# EAGLE design h_bridge_board (EAGLE 7.2.0)
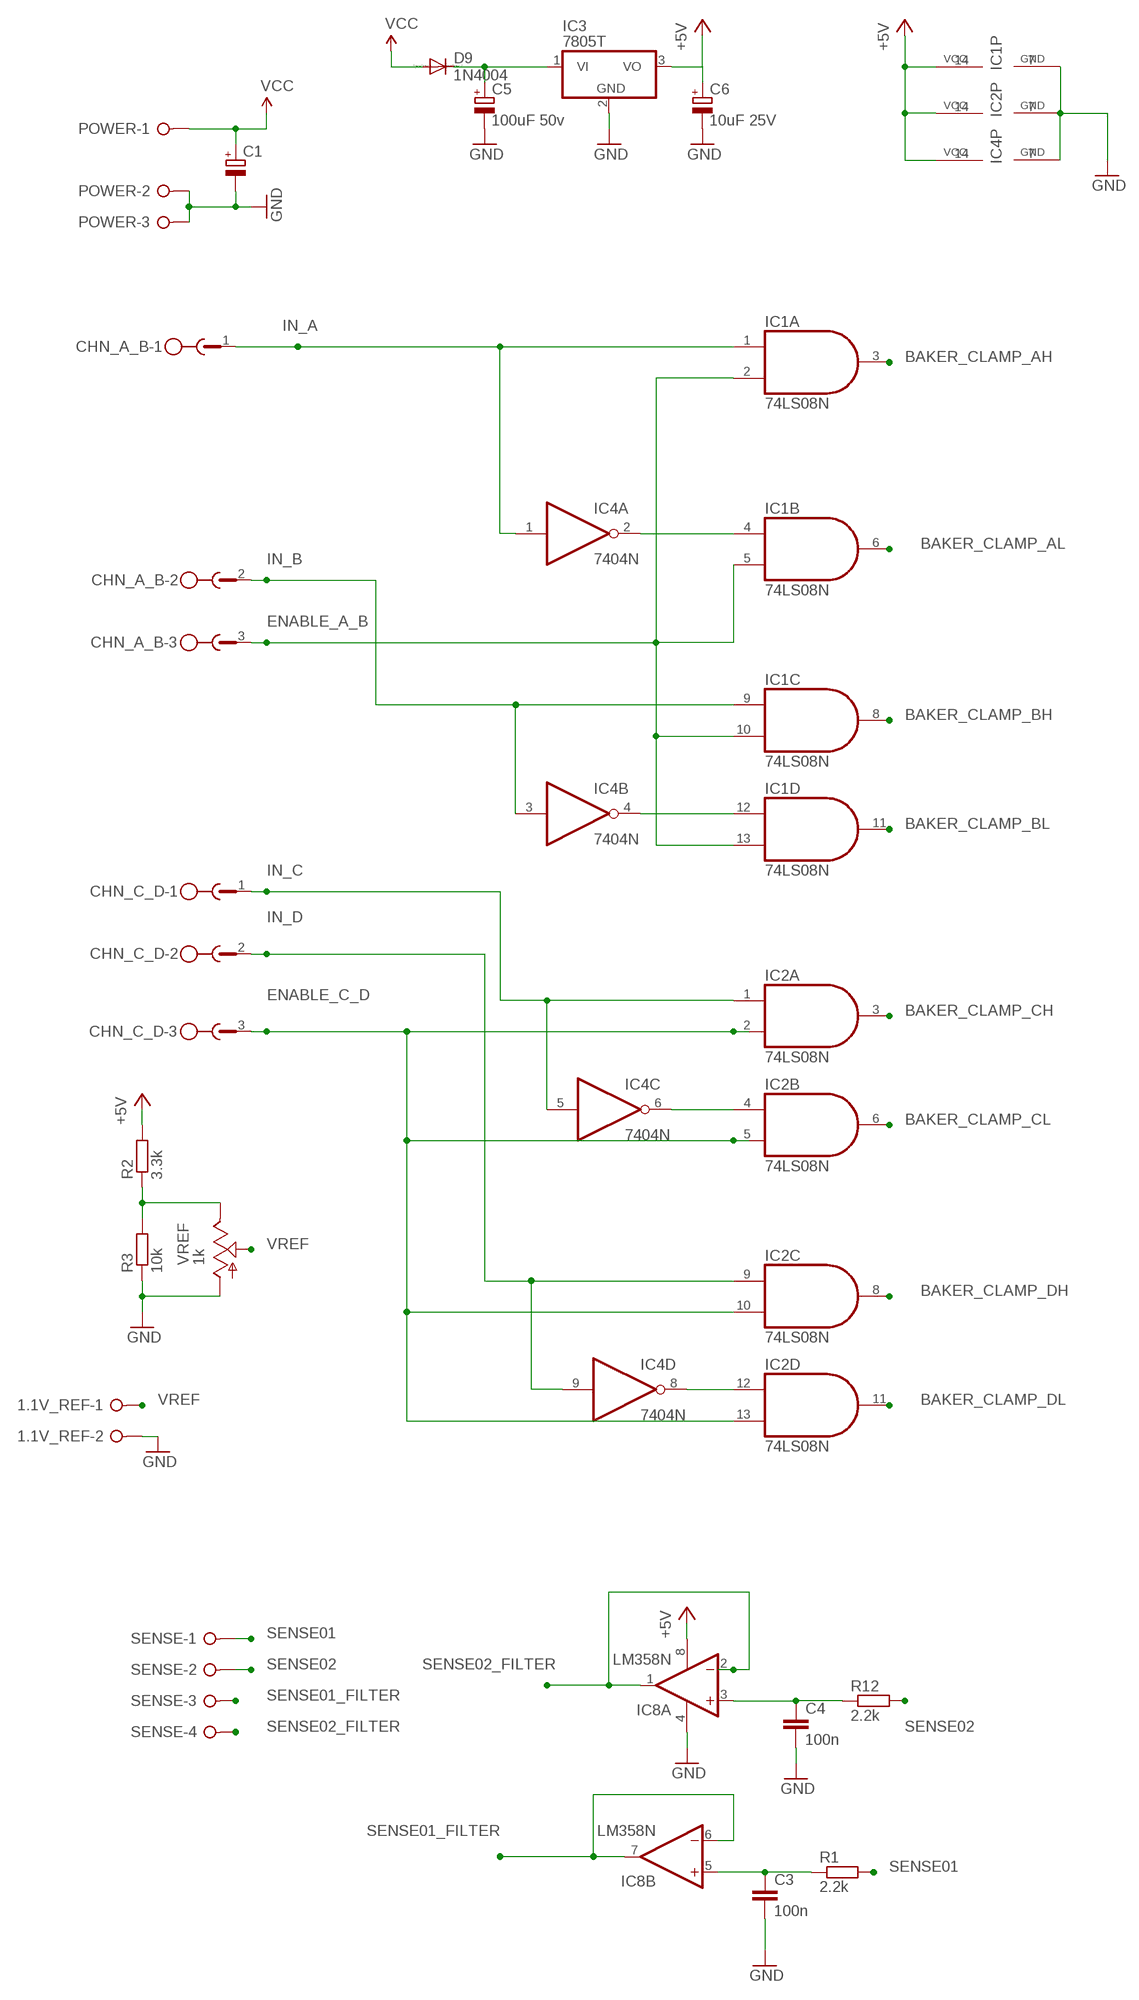
[diagram p0: schematic, sheet 1, part 1 of 2]
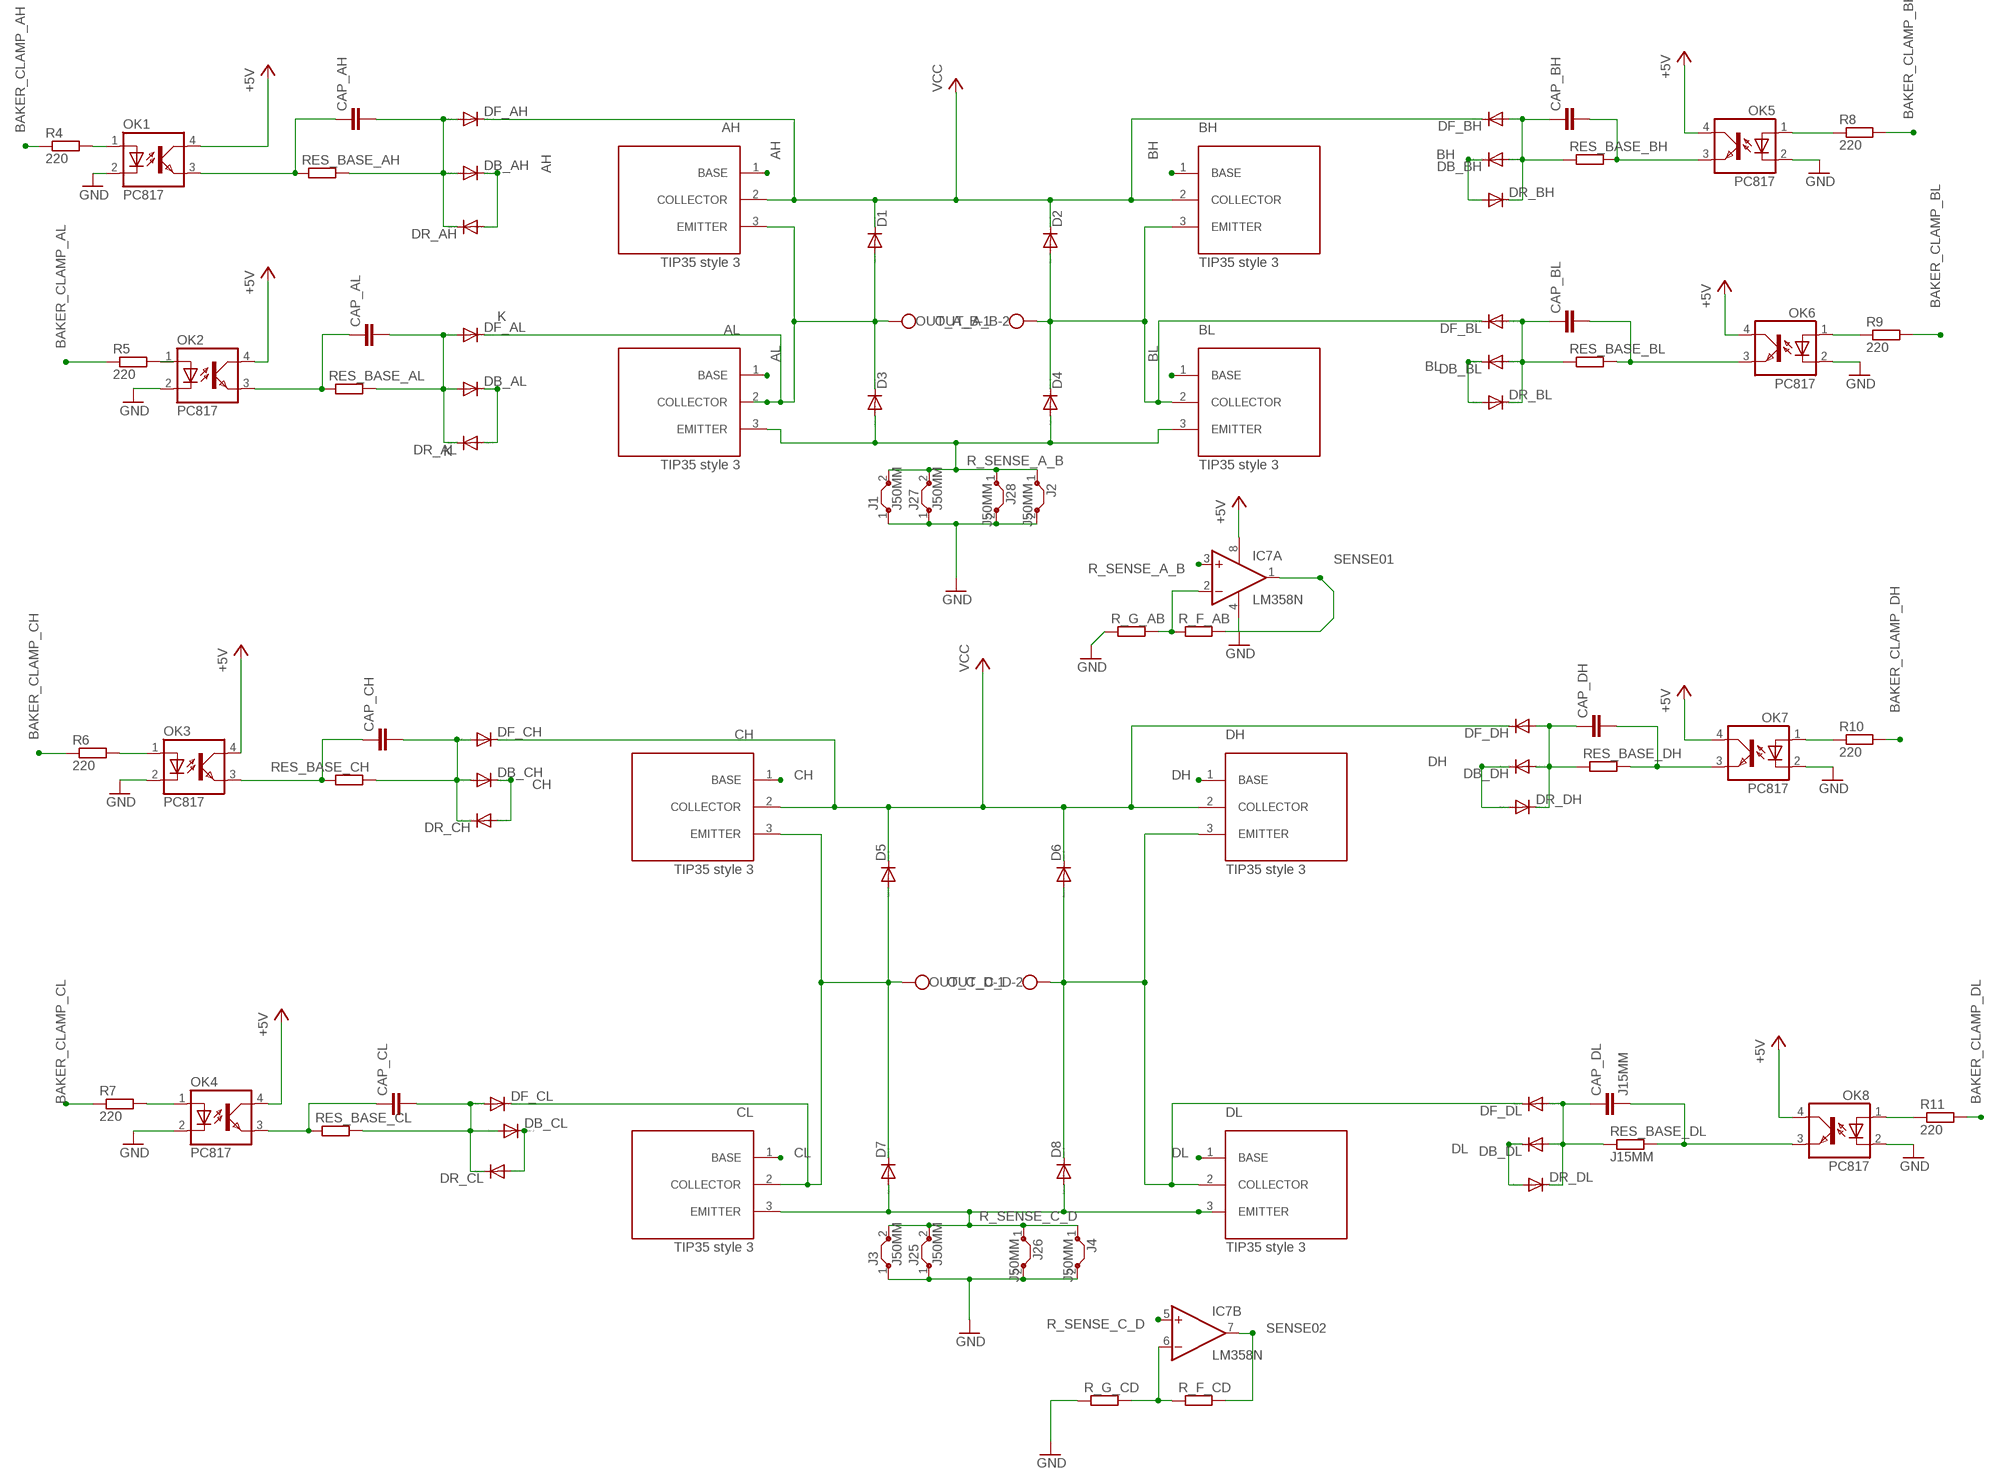
[diagram p1: schematic, sheet 1, part 2 of 2]

## Parts
1.1V_REF  W237-02P  [W237-132]
AH  TIP35_STYLE3  [P-TO247]
AL  TIP35_STYLE3  [P-TO247]
BH  TIP35_STYLE3  [P-TO247]
BL  TIP35_STYLE3  [P-TO247]
C1  CPOL-EUE5-10.5  [E5-10,5]
C3  100n  C-EU050-030X075  [C050-030X075]
C4  100n  C-EU050-030X075  [C050-030X075]
C5  100uF 50v  CPOL-EUE5-10.5  [E5-10,5]
C6  10uF 25V  CPOL-EUE2.5-6  [E2,5-6]
CAP_AH  C-EU050-030X075  [C050-030X075]
CAP_AL  C-EU050-030X075  [C050-030X075]
CAP_BH  C-EU050-030X075  [C050-030X075]
CAP_BL  C-EU050-030X075  [C050-030X075]
CAP_CH  C-EU050-030X075  [C050-030X075]
CAP_CL  C-EU050-030X075  [C050-030X075]
CAP_DH  C-EU050-030X075  [C050-030X075]
CAP_DL  J15MM  C-EU050-030X075  [C050-030X075]
CH  TIP35_STYLE3  [P-TO247]
CHN_A_B  W232-3  [W232-3]
CHN_C_D  W232-3  [W232-3]
CL  TIP35_STYLE3  [P-TO247]
D1  DIODE-DO27-15  [DO27-15]
D2  DIODE-DO27-15  [DO27-15]
D3  DIODE-DO27-15  [DO27-15]
D4  DIODE-DO27-15  [DO27-15]
D5  DIODE-DO27-15  [DO27-15]
D6  DIODE-DO27-15  [DO27-15]
D7  DIODE-DO27-15  [DO27-15]
D8  DIODE-DO27-15  [DO27-15]
D9  1N4004  [DO41-10]
DB_AH  DIODE-DO27-15  [DO27-15]
DB_AL  DIODE-DO27-15  [DO27-15]
DB_BH  DIODE-DO27-15  [DO27-15]
DB_BL  DIODE-DO27-15  [DO27-15]
DB_CH  DIODE-DO27-15  [DO27-15]
DB_CL  DIODE-DO27-15  [DO27-15]
DB_DH  DIODE-DO27-15  [DO27-15]
DB_DL  DIODE-DO27-15  [DO27-15]
DF_AH  DIODE-DO27-15  [DO27-15]
DF_AL  DIODE-DO27-15  [DO27-15]
DF_BH  DIODE-DO27-15  [DO27-15]
DF_BL  DIODE-DO27-15  [DO27-15]
DF_CH  DIODE-DO27-15  [DO27-15]
DF_CL  DIODE-DO27-15  [DO27-15]
DF_DH  DIODE-DO27-15  [DO27-15]
DF_DL  DIODE-DO27-15  [DO27-15]
DH  TIP35_STYLE3  [P-TO247]
DL  TIP35_STYLE3  [P-TO247]
DR_AH  DIODE-DO27-15  [DO27-15]
DR_AL  DIODE-DO27-15  [DO27-15]
DR_BH  DIODE-DO27-15  [DO27-15]
DR_BL  DIODE-DO27-15  [DO27-15]
DR_CH  DIODE-DO27-15  [DO27-15]
DR_CL  DIODE-DO27-15  [DO27-15]
DR_DH  DIODE-DO27-15  [DO27-15]
DR_DL  DIODE-DO27-15  [DO27-15]
IC1  74LS08N  [DIL14]
IC2  74LS08N  [DIL14]
IC3  7805T  [TO220H]
IC4  7404N  [DIL14]
IC7  LM358N  [DIL08]
IC8  LM358N  [DIL08]
J1  J50MM  [50]
J2  J50MM  [50]
J3  J50MM  [50]
J4  J50MM  [50]
J25  J50MM  [50]
J26  J50MM  [50]
J27  J50MM  [50]
J28  J50MM  [50]
OK1  PC817  [DIL04]
OK2  PC817  [DIL04]
OK3  PC817  [DIL04]
OK4  PC817  [DIL04]
OK5  PC817  [DIL04]
OK6  PC817  [DIL04]
OK7  PC817  [DIL04]
OK8  PC817  [DIL04]
OUT_A_B  W237-102  [W237-102]
OUT_C_D  W237-102  [W237-102]
POWER  W237-3E  [W237-3E]
R1  2.2k  R-EU_0207/10  [0207/10]
R2  3.3k  R-EU_0207/10  [0207/10]
R3  10k  R-EU_0207/10  [0207/10]
R4  220  R-EU_0207/10  [0207/10]
R5  220  R-EU_0207/10  [0207/10]
R6  220  R-EU_0207/10  [0207/10]
R7  220  R-EU_0207/10  [0207/10]
R8  220  R-EU_0207/10  [0207/10]
R9  220  R-EU_0207/10  [0207/10]
R10  220  R-EU_0207/10  [0207/10]
R11  220  R-EU_0207/10  [0207/10]
R12  2.2k  R-EU_0207/10  [0207/10]
R_F_AB  R-EU_0207/10  [0207/10]
R_F_CD  R-EU_0207/10  [0207/10]
R_G_AB  R-EU_0207/10  [0207/10]
R_G_CD  R-EU_0207/10  [0207/10]
RES_BASE_AH  R-EU_0207/10  [0207/10]
RES_BASE_AL  R-EU_0207/10  [0207/10]
RES_BASE_BH  R-EU_0207/10  [0207/10]
RES_BASE_BL  R-EU_0207/10  [0207/10]
RES_BASE_CH  R-EU_0207/10  [0207/10]
RES_BASE_CL  R-EU_0207/10  [0207/10]
RES_BASE_DH  R-EU_0207/10  [0207/10]
RES_BASE_DL  J15MM  R-EU_0207/10  [0207/10]
SENSE  W237-04P  [W237-4P]
VREF  1k  TRIM_US-B25U  [B25U]

## Nets
+5V: C6.+ IC1.14(P:VCC) IC2.14(P:VCC) IC3.3(VO) IC4.14(P:VCC) IC7.8(P:V+) IC8.8(P:V+) OK1.4(COL) OK2.4(COL) OK3.4(COL) OK4.4(COL) OK5.4(COL) OK6.4(COL) OK7.4(COL) OK8.4(COL) R2.2
AH: AH.1(BASE) DB_AH.C DR_AH.A
AL: AL.1(BASE) DB_AL.C DR_AL.A
BAKER_CLAMP_AH: IC1.3(A:O) R4.1
BAKER_CLAMP_AL: IC1.6(B:O) R5.1
BAKER_CLAMP_BH: IC1.8(C:O) R8.2
BAKER_CLAMP_BL: IC1.11(D:O) R9.2
BAKER_CLAMP_CH: IC2.3(A:O) R6.1
BAKER_CLAMP_CL: IC2.6(B:O) R7.1
BAKER_CLAMP_DH: IC2.8(C:O) R10.2
BAKER_CLAMP_DL: IC2.11(D:O) R11.2
BH: BH.1(BASE) DB_BH.C DR_BH.A
BL: BL.1(BASE) DB_BL.C DR_BL.A
CH: CH.1(BASE) DB_CH.C DR_CH.A
CL: CL.1(BASE) DB_CL.C DR_CL.A
DH: DB_DH.C DH.1(BASE) DR_DH.A
DL: DB_DL.C DL.1(BASE) DR_DL.A
ENABLE_A_B: CHN_A_B.3 IC1.2(A:I1) IC1.5(B:I1) IC1.10(C:I1) IC1.13(D:I1)
ENABLE_C_D: CHN_C_D.3 IC2.2(A:I1) IC2.5(B:I1) IC2.10(C:I1) IC2.13(D:I1)
GND: 1.1V_REF.2 C1.- C3.2 C4.2 C5.- C6.- IC1.7(P:GND) IC2.7(P:GND) IC3.2(GND) IC4.7(P:GND) IC7.4(P:V-) IC8.4(P:V-) J1.1 J2.2 J3.1 J4.2 J25.1 J26.2 J27.1 J28.2 OK1.2(C) OK2.2(C) OK3.2(C) OK4.2(C) OK5.2(C) OK6.2(C) OK7.2(C) OK8.2(C) POWER.2 POWER.3 R3.1 R_G_AB.1 R_G_CD.1 VREF.A
IN_A: CHN_A_B.1 IC1.1(A:I0) IC4.1(A:I)
IN_B: CHN_A_B.2 IC1.9(C:I0) IC4.3(B:I)
IN_C: CHN_C_D.1 IC2.1(A:I0) IC4.5(C:I)
IN_D: CHN_C_D.2 IC2.9(C:I0) IC4.9(D:I)
N$1: IC1.12(D:I0) IC4.4(B:O)
N$2: R2.1 R3.2 VREF.E
N$3: C5.+ D9.C IC3.1(VI)
N$4: CAP_AL.2 DB_AL.A DF_AL.A DR_AL.C RES_BASE_AL.2
N$5: CAP_CH.2 DB_CH.A DF_CH.A DR_CH.C RES_BASE_CH.1
N$6: CAP_BL.1 DB_BL.A DF_BL.A DR_BL.C RES_BASE_BL.1
N$8: CAP_DH.1 DB_DH.A DF_DH.A DR_DH.C RES_BASE_DH.1
N$11: IC2.4(B:I0) IC4.6(C:O)
N$12: OK1.1(A) R4.2
N$13: IC2.12(D:I0) IC4.8(D:O)
N$14: OK2.1(A) R5.2
N$15: OK3.1(A) R6.2
N$16: IC7.6(B:-IN) R_F_CD.1 R_G_CD.2
N$17: OK4.1(A) R7.2
N$18: IC7.2(A:-IN) R_F_AB.1 R_G_AB.2
N$19: CAP_CL.2 DB_CL.A DF_CL.A DR_CL.C RES_BASE_CL.2
N$20: CAP_AH.2 DB_AH.A DF_AH.A DR_AH.C RES_BASE_AH.2
N$21: CAP_BH.1 DB_BH.A DF_BH.A DR_BH.C RES_BASE_BH.1
N$25: IC1.4(B:I0) IC4.2(A:O)
N$27: OK8.1(A) R11.1
N$29: CAP_DL.1 DB_DL.A DF_DL.A DR_DL.C RES_BASE_DL.1
N$30: OK7.1(A) R10.1
N$32: OK6.1(A) R9.1
N$33: OK5.1(A) R8.1
N$34: CAP_DL.2 OK8.3(EMIT) RES_BASE_DL.2
N$35: CAP_BH.2 OK5.3(EMIT) RES_BASE_BH.2
N$36: CAP_BL.2 OK6.3(EMIT) RES_BASE_BL.2
N$37: CAP_DH.2 OK7.3(EMIT) RES_BASE_DH.2
N$38: CAP_CL.1 OK4.3(EMIT) RES_BASE_CL.1
N$39: CAP_CH.1 OK3.3(EMIT) RES_BASE_CH.2
N$42: CAP_AL.1 OK2.3(EMIT) RES_BASE_AL.1
N$43: CAP_AH.1 OK1.3(EMIT) RES_BASE_AH.1
N$46: C3.1 IC8.5(B:+IN) R1.1
N$47: C4.1 IC8.3(A:+IN) R12.1
OUT_A: AH.3(EMITTER) AL.2(COLLECTOR) D1.A D3.C DF_AL.C OUT_A_B.1
OUT_B: BH.3(EMITTER) BL.2(COLLECTOR) D2.A D4.C DF_BL.C OUT_A_B.2
OUT_C: CH.3(EMITTER) CL.2(COLLECTOR) D5.A D7.C DF_CL.C OUT_C_D.1
OUT_D: D6.A D8.C DF_DL.C DH.3(EMITTER) DL.2(COLLECTOR) OUT_C_D.2
R_SENSE_A_B: AL.3(EMITTER) BL.3(EMITTER) D3.A D4.A IC7.3(A:+IN) J1.2 J2.1 J27.2 J28.1
R_SENSE_C_D: CL.3(EMITTER) D7.A D8.A DL.3(EMITTER) IC7.5(B:+IN) J3.2 J4.1 J25.2 J26.1
SENSE01: IC7.1(A:OUT) R1.2 R_F_AB.2 SENSE.1
SENSE01_FILTER: IC8.6(B:-IN) IC8.7(B:OUT) SENSE.3
SENSE02: IC7.7(B:OUT) R12.2 R_F_CD.2 SENSE.2
SENSE02_FILTER: IC8.1(A:OUT) IC8.2(A:-IN) SENSE.4
VCC: AH.2(COLLECTOR) BH.2(COLLECTOR) C1.+ CH.2(COLLECTOR) D1.C D2.C D5.C D6.C D9.A DF_AH.C DF_BH.C DF_CH.C DF_DH.C DH.2(COLLECTOR) POWER.1
VREF: 1.1V_REF.1 VREF.S
Unconnected: IC4.10(E:O) IC4.11(E:I) IC4.12(F:O) IC4.13(F:I)

## Notes on the sheet
- K
- K

## Library data of the parts
1.1V_REF = con-wago-508:W237-02P: WAGO SREW CLAMP; OC_FARNELL: unknown; OC_NEWARK: unknown
AH AL BH BL CH CL DH DL = tip35_style3:TIP35_STYLE3
C1 C5 C6 = rcl:CPOL-EU: POLARIZED CAPACITOR, European symbol
C3 C4 CAP_AH CAP_AL CAP_BH CAP_BL CAP_CH CAP_CL CAP_DH CAP_DL = rcl:C-EU: CAPACITOR, European symbol
CHN_A_B CHN_C_D = con-wago-508:W232-3: WAGO SREW CLAMP; OC_FARNELL: unknown; OC_NEWARK: unknown
D1-D8 DB_AH DB_AL DB_BH DB_BL DB_CH DB_CL DB_DH DB_DL DF_AH DF_AL DF_BH DF_BL DF_CH DF_CL DF_DH DF_DL DR_AH DR_AL DR_BH DR_BL DR_CH DR_CL DR_DH DR_DL = diode:DIODE-: DIODE
D9 = diode:1N4004: DIODE general purpose rectifier, 1 A
IC1 IC2 = 74xx-us:74*08: Quad 2-input AND gate
IC3 = linear:78*: Positive VOLTAGE REGULATOR Source: http://cache.national.com/ds/LM/LM78L05.pdf http://www.fairchildsemi.com/ds/LM/LM7805.pdf
IC4 = 74xx-us:74*04: Hex INVERTER
IC7 IC8 = linear:LM358: OP AMP also LM158; LM258; LM2904 Source: http://cache.national.com/ds/LM/LM158.pdf
J1-J4 J25-J28 = jumper:J: Bridge
OK1-OK8 = optocoupler:PC817: SHARP OPTO COUPLER; MPN: PC817X4J000F; OC_FARNELL: 9707727; OC_NEWARK: 97K7059
OUT_A_B OUT_C_D = con-wago-500:W237-102: WAGO SCREW CLAMP; MPN: 237-102; OC_FARNELL: unknown; OC_NEWARK: 70K9898
POWER = con-wago-508:W237-3E: WAGO SREW CLAMP; OC_FARNELL: unknown; OC_NEWARK: unknown
R1-R12 R_F_AB R_F_CD R_G_AB R_G_CD RES_BASE_AH RES_BASE_AL RES_BASE_BH RES_BASE_BL RES_BASE_CH RES_BASE_CL RES_BASE_DH RES_BASE_DL = rcl:R-EU_: RESISTOR, European symbol
SENSE = con-wago-508:W237-04P: WAGO SREW CLAMP; OC_FARNELL: unknown; OC_NEWARK: unknown
VREF = pot:TRIM_US-: POTENTIOMETER

## Board
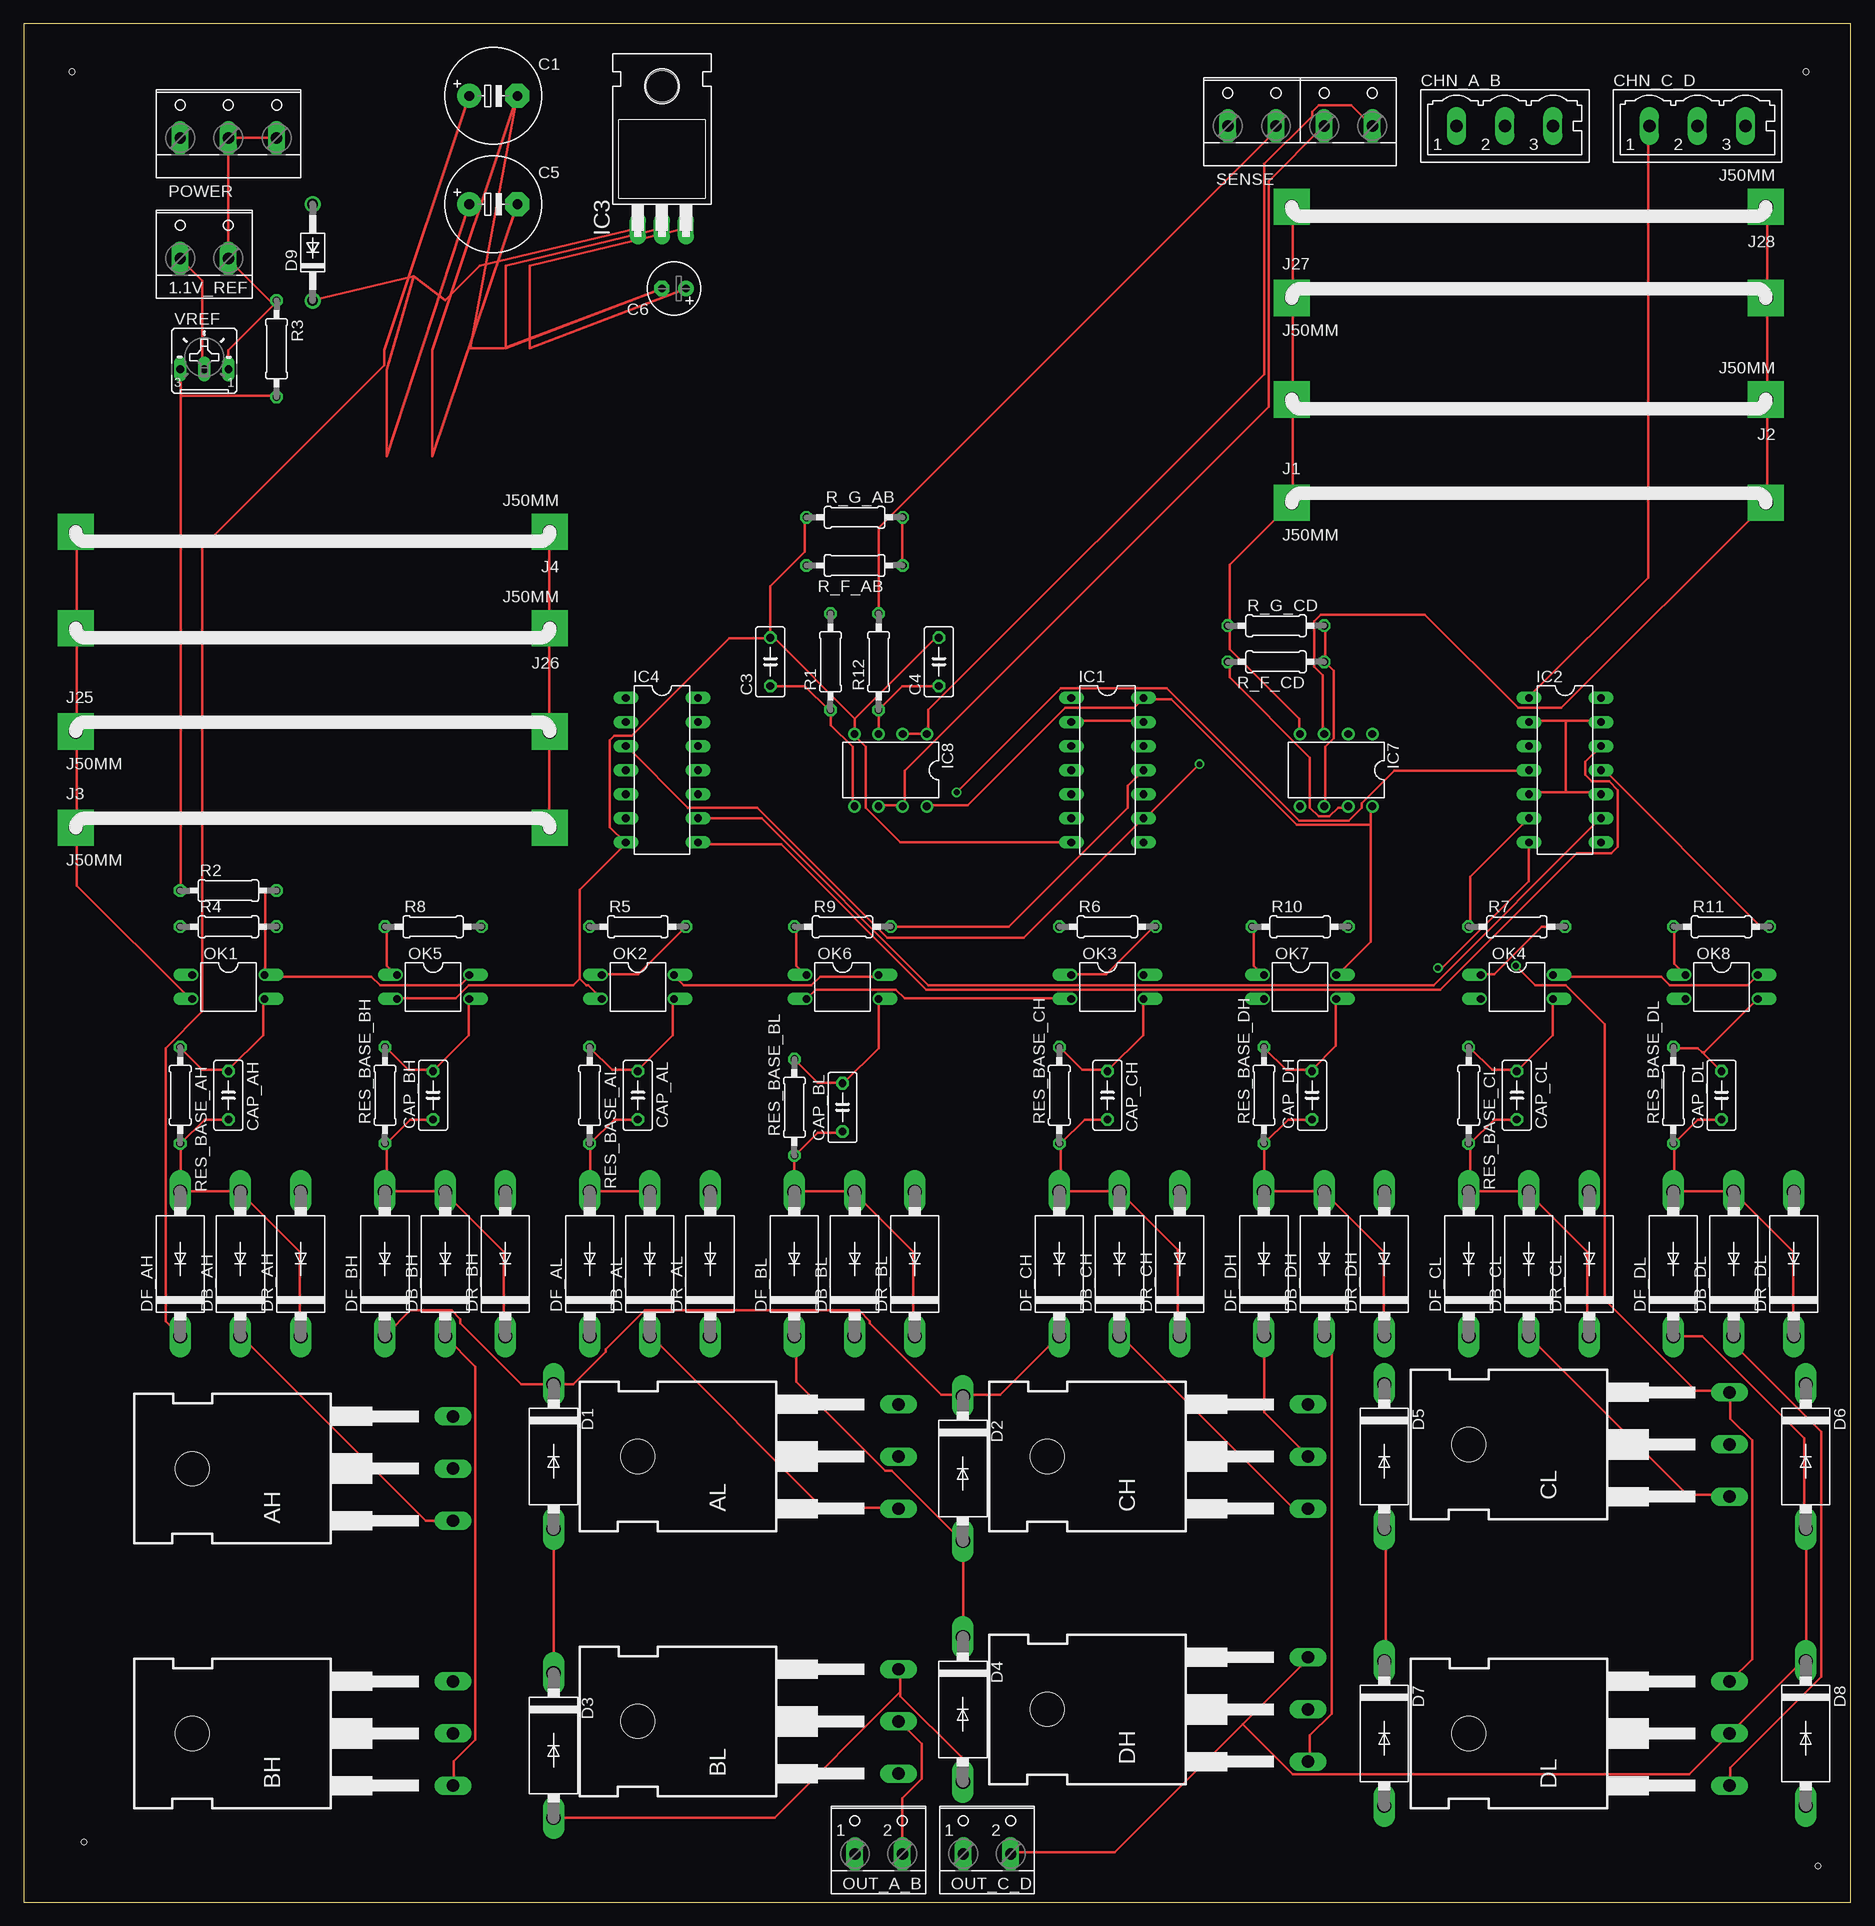
[diagram p2: board, top side]
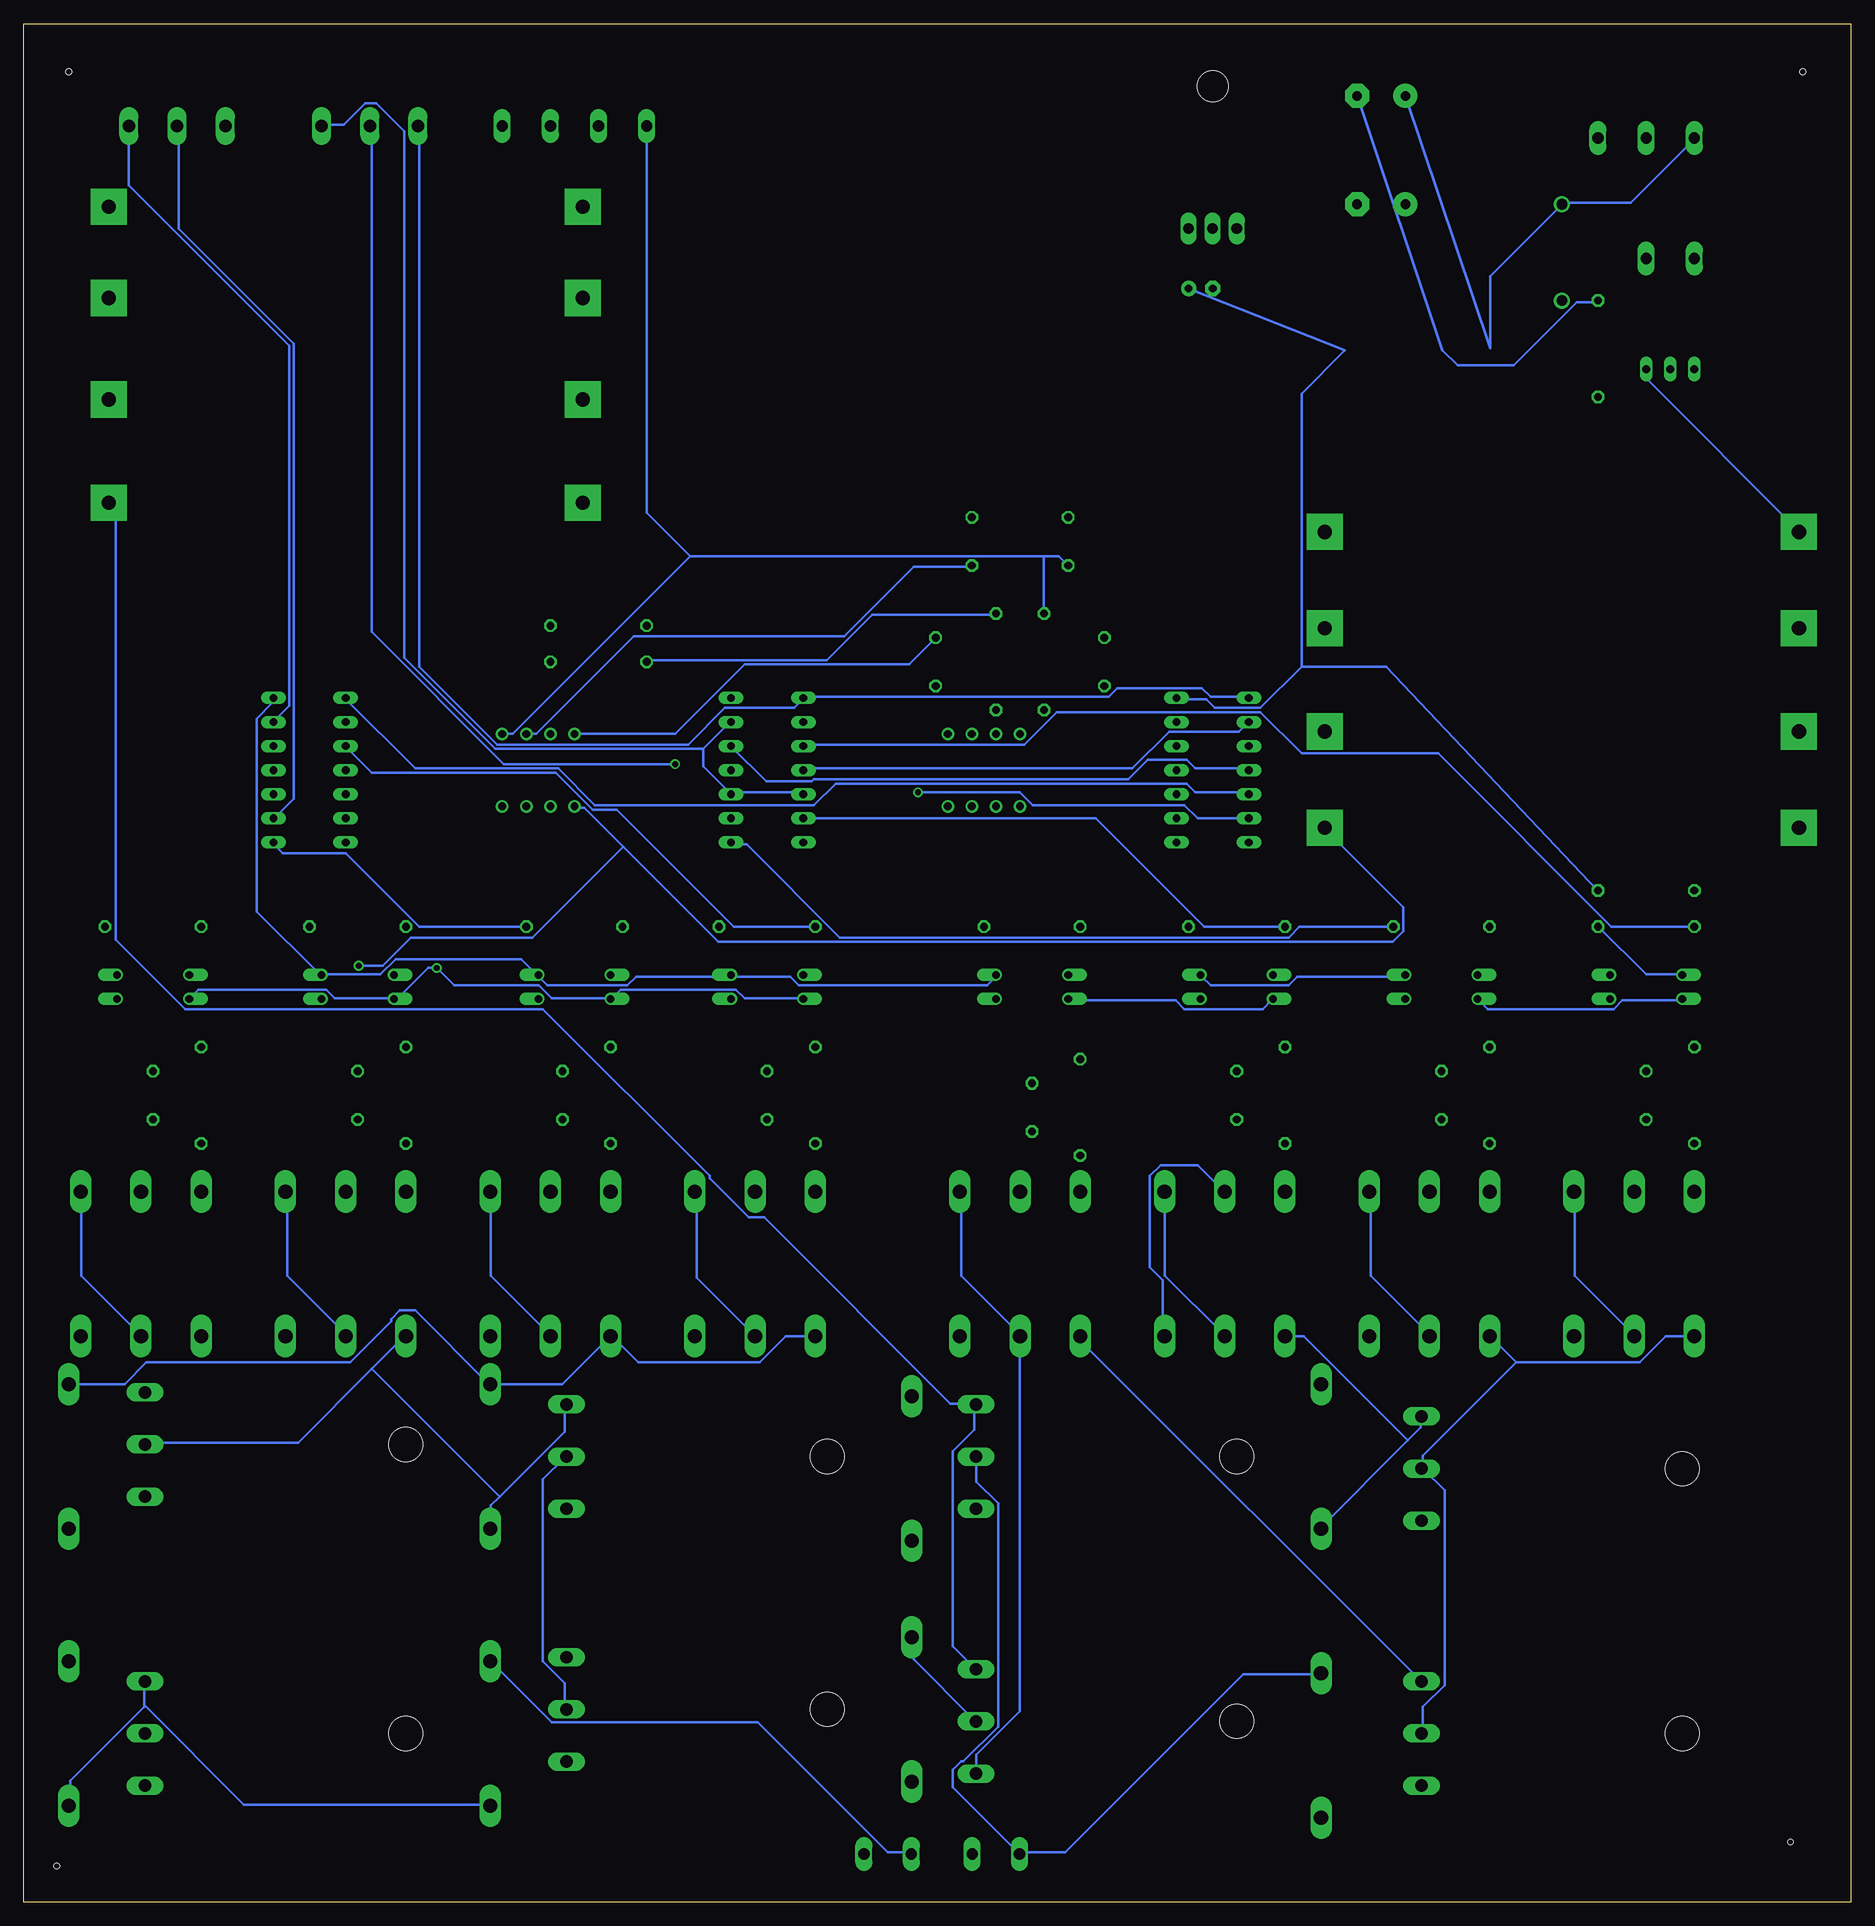
[diagram p3: board, bottom side, seen from below]

Size 192.71 x 198.11 mm. Coordinates in mm from the lower left corner, seen from the top.
Outline: 0,0 192.71,0 192.71,198.11 0,198.11 0,0
Copper layers (1*16): Top 0.035mm / dielectric 1.5mm / Bottom 0.035mm
Design rules "default *": minimum track width 10mil, minimum drill 24mil, track to track 8mil, track to pad 8mil, pad to pad 8mil, via to via 8mil, smd to smd 8mil, copper to edge 100mil, drill to drill 8mil, minimum pad ring 10mil, minimum via ring 8mil, stop-mask expansion 4mil, vias tented up to drill 0mil, thermal gap 10mil
Holes 0.6 mm at 5.08,193.04 187.96,193.04 6.35,6.35 189.23,3.81

### Footprints (pad centres in the part's own frame; a part is rotated, then mirrored left to right if it is on the bottom)
W237-132 = drill 1.194 long: 1 -2.54,-0.635; 2 2.54,-0.635
P-TO247 = drill 1.3 long: 1 -5.5,-27.5; 2 0,-27.5; 3 5.5,-27.5 | hole 3.6: 0,0
E5-10,5 = drill 1.016 pad 2.54: + -2.54,0 | drill 1.016 pad 2.54 octagon: - 2.54,0
C050-030X075 = drill 0.813 octagon: 1 -2.54,0; 2 2.54,0
E2,5-6 = drill 0.813 pad 1.6: + -1.27,0 | drill 0.813 pad 1.6 octagon: - 1.27,0
W232-3 = drill 1.321 long: 1 -5.08,-0.635; 2 0,-0.635; 3 5.08,-0.635
DO27-15 = drill 1.499 long: A 7.62,0; C -7.62,0
DO41-10 = drill 1.118: A 5.08,0; C -5.08,0
DIL14 = drill 0.813 long: 1 -7.62,-3.81; 2 -5.08,-3.81; 3 -2.54,-3.81; 4 0,-3.81; 5 2.54,-3.81; 6 5.08,-3.81; 7 7.62,-3.81; 8 7.62,3.81; 9 5.08,3.81; 10 2.54,3.81; 11 0,3.81; 12 -2.54,3.81; 13 -5.08,3.81; 14 -7.62,3.81
TO220H = drill 1.118 long: 1 -2.54,-10.16; 2 0,-10.16; 3 2.54,-10.16 | hole 3.302: 0,4.826
DIL08 = drill 0.813 pad 1.27: 1 -3.81,-3.81; 2 -1.27,-3.81; 3 1.27,-3.81; 4 3.81,-3.81; 5 3.81,3.81; 6 1.27,3.81; 7 -1.27,3.81; 8 -3.81,3.81
50 = drill 1.5 pad 3.81 square: 1 -25,-1; 2 25,-1
DIL04 = drill 0.813 offset: 1 -1.27,-3.81; 2 1.27,-3.81; 3 1.27,3.81; 4 -1.27,3.81
W237-102 = drill 1.194 long: 1 -2.5,-1.27; 2 2.5,-1.27
W237-3E = drill 1.194 long: 1 -5.08,-0.635; 2 0,-0.635; 3 5.08,-0.635
0207/10 = drill 0.813 octagon: 1 -5.08,0; 2 5.08,0
W237-4P = drill 1.194 long: 1 -7.62,-0.635; 2 -2.54,-0.635; 3 2.54,-0.635; 4 7.62,-0.635
B25U = drill 0.813 long: A 2.54,-0.889; E -2.54,-0.889; S 0,-0.889

### Placement (x,y rotation side)
1.1V_REF  19.05,173.99 0 top
AH  17.78,45.72 90 top
AL  64.77,46.99 90 top
BH  17.78,17.78 90 top
BL  64.77,19.05 90 top
C1  49.53,190.5 0 top
C3  78.74,130.81 90 top
C4  96.52,130.81 90 top
C5  49.53,179.07 0 top
C6  68.58,170.18 180 top
CAP_AH  21.59,85.09 270 top
CAP_AL  64.77,85.09 270 top
CAP_BH  43.18,85.09 90 top
CAP_BL  86.36,83.82 90 top
CAP_CH  114.3,85.09 270 top
CAP_CL  157.48,85.09 270 top
CAP_DH  135.89,85.09 90 top
CAP_DL  179.07,85.09 90 top
CH  107.95,46.99 90 top
CHN_A_B  156.21,187.96 0 top
CHN_C_D  176.53,187.96 0 top
CL  152.4,48.26 90 top
D1  55.88,46.99 270 top
D2  99.06,45.72 270 top
D3  55.88,16.51 270 top
D4  99.06,20.32 270 top
D5  143.51,46.99 270 top
D6  187.96,46.99 270 top
D7  143.51,17.78 270 top
D8  187.96,17.78 270 top
D9  30.48,173.99 90 top
DB_AH  22.86,67.31 90 top
DB_AL  66.04,67.31 90 top
DB_BH  44.45,67.31 90 top
DB_BL  87.63,67.31 90 top
DB_CH  115.57,67.31 90 top
DB_CL  158.75,67.31 90 top
DB_DH  137.16,67.31 90 top
DB_DL  180.34,67.31 90 top
DF_AH  16.51,67.31 90 top
DF_AL  59.69,67.31 90 top
DF_BH  38.1,67.31 90 top
DF_BL  81.28,67.31 90 top
DF_CH  109.22,67.31 90 top
DF_CL  152.4,67.31 90 top
DF_DH  130.81,67.31 90 top
DF_DL  173.99,67.31 90 top
DH  107.95,20.32 90 top
DL  152.4,17.78 90 top
DR_AH  29.21,67.31 90 top
DR_AL  72.39,67.31 90 top
DR_BH  50.8,67.31 90 top
DR_BL  93.98,67.31 90 top
DR_CH  121.92,67.31 90 top
DR_CL  165.1,67.31 90 top
DR_DH  143.51,67.31 90 top
DR_DL  186.69,67.31 90 top
IC1  114.3,119.38 270 top
IC2  162.56,119.38 270 top
IC3  67.31,186.69 0 top
IC4  67.31,119.38 270 top
IC7  138.43,119.38 180 top
IC8  91.44,119.38 180 top
J1  158.75,148.59 0 top
J2  158.75,157.48 180 top
J3  30.48,114.3 0 top
J4  30.48,143.51 180 top
J25  30.48,124.46 0 top
J26  30.48,133.35 180 top
J27  158.75,170.18 0 top
J28  158.75,177.8 180 top
OK1  21.59,96.52 270 top
OK2  64.77,96.52 270 top
OK3  114.3,96.52 270 top
OK4  157.48,96.52 270 top
OK5  43.18,96.52 270 top
OK6  86.36,96.52 270 top
OK7  134.62,96.52 270 top
OK8  179.07,96.52 270 top
OUT_A_B  90.17,6.35 0 top
OUT_C_D  101.6,6.35 0 top
POWER  21.59,186.69 0 top
R1  85.09,130.81 90 top
R2  21.59,106.68 0 top
R3  26.67,163.83 270 top
R4  21.59,102.87 0 top
R5  64.77,102.87 0 top
R6  114.3,102.87 0 top
R7  157.48,102.87 0 top
R8  43.18,102.87 0 top
R9  86.36,102.87 0 top
R10  134.62,102.87 0 top
R11  179.07,102.87 0 top
R12  90.17,130.81 90 top
R_F_AB  87.63,140.97 180 top
R_F_CD  132.08,130.81 180 top
R_G_AB  87.63,146.05 0 top
R_G_CD  132.08,134.62 0 top
RES_BASE_AH  16.51,85.09 270 top
RES_BASE_AL  59.69,85.09 270 top
RES_BASE_BH  38.1,85.09 90 top
RES_BASE_BL  81.28,83.82 90 top
RES_BASE_CH  109.22,85.09 90 top
RES_BASE_CL  152.4,85.09 270 top
RES_BASE_DH  130.81,85.09 90 top
RES_BASE_DL  173.99,85.09 90 top
SENSE  134.62,187.96 0 top
VREF  19.05,162.56 0 top

### Tracks (layer width: path | path; a pad name or v marks a point on that pad's centre or on a via)
+5V
  Top 0.254: OK4.4 161.49,97.61 172.69,97.61 173.61,96.7 181.84,96.7 182.75,97.61 OK8.4 | IC8.8 95.43,115.67 99.54,115.67 109.83,125.96 117.14,125.96 118.06,126.87 IC1.14 118.29,126.87 121.03,126.87 134.29,113.61 142.06,113.61 | 142.06,113.61 142.06,101.27 138.63,97.84 OK7.4 | 142.06,113.61 142.06,115.44 IC7.8 | IC3.3 53.36,172.59 53.36,163.91 C6.+ | R2.2 25.48,106.76 25.48,97.84 OK1.4 25.48,97.61 36.68,97.61 37.59,96.7 46.05,96.7 46.97,97.61 OK5.4 | OK6.4 90.17,97.61 84,97.61 83.08,96.7 69.6,96.7 68.68,97.61 OK2.4
  Bottom 0.254: IC2.14 166.52,126.87 166.52,126.42 168.12,124.82 168.12,104.47 161.49,97.84 OK4.4 161.26,97.84 155.09,97.84 153.49,99.44 140.23,99.44 138.63,97.84 OK7.4 138.41,97.61 137.49,96.7 129.03,96.7 128.12,97.61 118.29,97.61 OK3.4 118.06,97.61 111.89,97.61 110.97,96.7 91.08,96.7 90.17,97.61 OK6.4 | 57.94,130.3 62.28,125.96 67.08,125.96 68,126.87 70.97,126.87 IC4.14 | 57.94,130.3 57.94,159.11 53.36,163.68 C6.+ | OK5.4 47.19,97.61 58.39,97.61 59.31,96.7 67.54,96.7 68.45,97.61 OK2.4 | 57.94,130.3 49.02,130.3 R2.2
AH
  Top 0.254: AH.1 45.14,40.23 42.39,40.23 22.96,59.66 DB_AH.C
  Bottom 0.254: DR_AH.A 29.13,74.75 29.13,66.06 22.96,59.89 DB_AH.C
AL
  Top 0.254: AL.1 92.23,41.6 84.23,41.6 66.17,59.66 DB_AL.C
  Bottom 0.254: DR_AL.A 72.34,74.75 72.34,66.06 66.17,59.89 DB_AL.C
BAKER_CLAMP_AH
  Bottom 0.254: R4.1 25.25,102.87 43.54,121.16 57.94,121.16 62.28,125.5 83.77,125.5 87.2,122.07 110.29,122.07 IC1.3
BAKER_CLAMP_AL
  Bottom 0.254: R5.1 68.22,102.87 79.65,114.3 IC1.6
BAKER_CLAMP_BH
  Bottom 0.254: R8.2 58.17,102.87 59.31,101.73 106.63,101.73 116.46,111.56 118.06,111.56 IC1.8
BAKER_CLAMP_BL
  Top 0.254: R9.2 103.89,102.87 116.46,115.44 116.46,117.73 IC1.11
BAKER_CLAMP_CH
  Bottom 0.254: R6.1 117.83,102.87 130.18,115.21 132.69,115.21 136.58,119.1 156.01,119.1 158.75,121.84 IC2.3
BAKER_CLAMP_CL
  Top 0.254: IC2.6 152.58,108.13 152.58,102.87 R7.1
BAKER_CLAMP_DH
  Bottom 0.254: R10.2 150.98,102.87 158.75,110.64 165.38,110.64 166.29,111.56 IC2.8
BAKER_CLAMP_DL
  Top 0.254: R11.2 183.21,102.87 166.52,119.56 IC2.11
BH
  Top 0.254: BH.1 45.36,12.34 45.36,14.86 47.65,17.14 47.65,56.46 44.45,59.66 DB_BH.C
  Bottom 0.254: DR_BH.A 50.62,74.75 50.62,66.06 44.45,59.89 DB_BH.C
BL
  Bottom 0.254: BL.1 92.23,13.72 92.23,15.54 87.66,20.12 87.66,59.66 DB_BL.C 87.66,59.89 93.83,66.06 93.83,74.75 DR_BL.A
CH
  Top 0.254: CH.1 135.43,41.6 133.83,41.6 115.77,59.66 DB_CH.C
  Bottom 0.254: DB_CH.C 121.72,65.84 121.72,74.75 DR_CH.A
CL
  Top 0.254: CL.1 179.78,42.98 175.44,42.98 158.75,59.66 DB_CL.C
  Bottom 0.254: DR_CL.A 164.92,74.75 164.92,66.06 158.75,59.89 DB_CL.C
DH
  Top 0.254: DH.1 135.66,14.86 135.66,17.6 137.95,19.89 137.95,58.98 137.26,59.66 DB_DH.C
  Bottom 0.254: DR_DH.A 143.43,74.75 143.43,66.06 137.26,59.89 DB_DH.C
DL
  Top 0.254: DL.1 180.01,12.34 180.01,14.17 189.61,23.77 189.61,49.61 180.47,58.75 180.47,59.66 DB_DL.C
  Bottom 0.254: DR_DL.A 186.64,74.75 186.64,66.06 180.47,59.89 DB_DL.C
ENABLE_A_B
  Top 0.254: IC1.2 110.52,124.59 118.06,124.59 IC1.13
  Bottom 0.254: IC1.5 110.52,117.04 118.06,117.04 IC1.10 118.29,117.04 121.03,119.79 121.03,121.61 | 121.03,121.61 142.98,121.61 152.58,131.22 152.58,186.77 155.55,189.74 156.69,189.74 158.98,187.45 161.26,187.45 CHN_A_B.3 | 121.03,121.61 118.29,124.36 IC1.13
ENABLE_C_D
  Top 0.254: 162.64,117.04 166.29,117.04 IC2.10 | 162.64,117.04 158.75,117.04 IC2.5 | 162.64,124.59 166.29,124.59 IC2.13 | 162.64,124.59 158.75,124.59 IC2.2 | 162.64,124.59 162.64,117.04
  Bottom 0.254: CHN_C_D.3 181.61,181.05 164.69,164.13 164.69,126.19 166.29,124.59 IC2.13
GND  (via drill 0.61)
  Top 0.254: IC2.7 158.75,107.67 149.61,98.53 v149.15,98.53 | J28.2 133.83,178.76 133.83,169.39 J27.1 133.83,169.16 133.83,158.65 J2.2 133.83,158.42 133.83,147.68 J1.1 133.6,147.45 127.2,141.05 127.2,134.65 R_G_CD.1 127.2,134.42 127.2,132.13 134.52,124.82 134.52,123.22 IC7.4 | POWER.3 26.62,186.08 21.59,186.08 POWER.2 1.1V_REF.2 21.59,173.28 26.39,168.48 | VREF.A 21.59,163.68 26.39,168.48 | 26.39,168.48 26.62,168.71 R3.1 26.39,168.48 | IC3.2 50.85,172.59 50.85,163.91 C6.- 50.62,163.91 47.12,163.91 C1.- 43.08,163.68 43.08,152.48 C5.- | 87.66,124.82 87.66,123.22 IC8.4 87.66,122.99 88.8,121.84 88.8,115.44 92.46,111.78 110.29,111.78 IC1.7 | 87.66,124.82 96.34,133.5 C4.2 | 78.74,133.27 79.2,133.27 87.66,124.82 | R_G_AB.1 82.4,145.85 82.4,142.42 78.74,138.76 C3.2 78.74,133.27 | J4.2 5.59,144.47 5.59,134.42 J26.2 5.59,134.19 5.59,123.67 J25.1 5.59,123.44 5.59,113.39 J3.1 5.59,113.16 5.59,107.21 17.7,95.1 OK1.2 | 58.62,97.38 59.31,96.7 59.54,96.7 60.91,95.33 OK2.2 | 58.62,97.38 58.62,106.76 63.42,111.56 IC4.7 63.42,111.78 61.82,113.39 61.82,122.53 62.28,122.99 64.11,122.99 74.4,133.27 78.74,133.27 | 58.62,97.38 57.94,96.7 46.97,96.7 45.59,95.33 39.42,95.33 OK5.2 | OK6.2 83.54,96.24 92,96.24 92.91,95.33 110.29,95.33 OK3.2
  Bottom 0.254: OK3.2 110.52,95.33 116.69,95.33 117.6,96.24 129.72,96.24 130.63,95.33 OK7.2 130.86,95.33 137.03,95.33 138.41,96.7 147.32,96.7 v149.15,98.53 150.06,98.53 153.49,95.1 OK4.2 153.72,95.33 159.89,95.33 160.81,96.24 174.29,96.24 175.21,95.33 OK8.2 | R3.1 26.85,168.71 28.91,168.71 35.53,162.08 41.48,162.08 43.08,163.68 C1.- | OK1.2 17.93,95.1 24.11,95.1 25.02,94.18 38.28,94.18 39.19,95.1 OK5.2 | OK6.2 82.4,95.1 71.2,95.1 70.28,94.18 62.05,94.18 61.14,95.1 OK2.2 | VREF.A 21.59,160.71 5.59,144.7 J4.2 | IC7.4 134.52,123.22 124,123.22 116.69,130.53 99.31,130.53 96.57,133.27 C4.2
IN_A
  Bottom 0.254: IC4.1 63.65,127.1 67.54,127.1 68.45,128.02 77.37,128.02 78.28,127.1 110.29,127.1 IC1.1 110.52,126.87 111.43,125.96 118.74,125.96 122.63,122.07 142.75,122.07 150.98,130.3 150.98,187.22 CHN_A_B.1
IN_B  (via drill 0.61)
  Top 0.254: IC4.3 63.65,121.84 70.05,115.44 77.37,115.44 91.08,101.73 105.49,101.73 118.06,114.3 IC1.9 118.29,114.3 v124,120.02
  Bottom 0.254: v124,120.02 142.06,120.02 156.01,133.96 156.01,187.22 CHN_A_B.2
IN_C
  Top 0.254: CHN_C_D.1 171.32,187.22 171.32,139.68 158.75,127.1 IC2.1
  Bottom 0.254: IC4.5 63.65,117.04 69.14,117.04 70.05,117.96 107.09,117.96 109.37,115.67 132.46,115.67 136.35,119.56 151.44,119.56 158.75,126.87 IC2.1
IN_D
  Top 0.254: IC4.9 77.83,114.3 95.43,96.7 148.69,96.7 166.29,114.3 IC2.9
  Bottom 0.254: CHN_C_D.2 176.35,187.22 176.35,176.48 164.24,164.36 164.24,116.36 166.29,114.3 IC2.9
N$1
  Bottom 0.254: IC4.4 63.65,119.56 69.14,119.56 70.05,120.47 74.17,120.47 76.22,118.42 109.37,118.42 109.6,118.19 114.4,118.19 118.06,121.84 IC1.12
N$2
  Top 0.254: 16.56,158.88 16.56,161.62 VREF.E | 16.56,158.88 16.56,108.13 R2.1 | 16.56,158.88 26.62,158.88 R3.2
N$3
  Top 0.254: 41.15,171.47 44.45,168.94 48.11,172.59 IC3.1 | 41.15,171.47 30.5,168.94 D9.C | 41.15,171.47 39.88,167.03 38.28,161.62 38.28,152.48 C5.+
N$4
  Top 0.254: 59.77,74.98 59.77,80.01 | 59.77,80.01 62.28,82.53 64.57,82.53 CAP_AL.2 | 59.77,80.01 RES_BASE_AL.2 | 59.77,74.98 65.94,74.98 DB_AL.A | 59.77,74.98 DF_AL.A
  Bottom 0.254: DR_AL.C 72.57,59.89 72.57,65.61 73.94,66.98 73.94,76.58 72.8,77.72 68.91,77.72 66.17,74.98 DB_AL.A
N$5
  Top 0.254: 109.37,74.98 109.37,80.01 | 109.37,80.01 111.89,82.53 114.17,82.53 CAP_CH.2 | 109.37,80.01 RES_BASE_CH.1 | 109.37,74.98 115.55,74.98 DB_CH.A 115.77,74.75 121.72,68.81 121.72,59.89 DR_CH.C | 109.37,74.98 DF_CH.A
N$6
  Top 0.254: CAP_BL.1 86.28,81.15 83.77,81.15 81.48,78.87 RES_BASE_BL.1 81.25,78.64 81.25,74.98 DF_BL.A 81.48,74.98 87.43,74.98 DB_BL.A 87.66,74.75 93.83,68.58 93.83,59.89 DR_BL.C
N$8
  Top 0.254: 130.86,74.98 130.86,80.01 | 130.86,80.01 133.38,82.53 135.89,82.53 CAP_DH.1 | 130.86,80.01 RES_BASE_DH.1 | 130.86,74.98 137.03,74.98 DB_DH.A 137.26,74.75 143.43,68.58 143.43,59.89 DR_DH.C | 130.86,74.98 DF_DH.A
N$11  (via drill 0.61)
  Top 0.254: v98.4,117.04 109.37,128.02 120.57,128.02 134.52,114.07 139.78,114.07 141.15,115.44 141.15,115.9 144.58,119.33 158.75,119.33 IC2.4
  Bottom 0.254: IC4.6 68.91,114.3 70.28,115.67 86.28,115.67 87.66,117.04 v98.4,117.04
N$12
  Bottom 0.254: OK1.1 17.93,97.84 21.59,97.84 26.62,102.87 R4.2
N$13
  Top 0.254: IC2.12 164.69,120.24 164.69,118.87 165.38,118.19 167.21,118.19 168.12,117.27 168.12,111.33 167.44,110.64 163.78,110.64 149.38,96.24 95.2,96.24 79.88,111.56 71.2,111.56 IC4.8
N$14
  Top 0.254: OK2.1 61.14,97.84 64.8,97.84 69.83,102.87 R5.2
N$15
  Top 0.254: OK3.1 110.52,97.84 114.17,97.84 119.2,102.87 R6.2
N$16
  Top 0.254: IC7.6 137.26,115.67 137.26,121.84 138.18,122.76 138.18,129.84 137.26,130.76 R_F_CD.1 137.26,130.99 137.26,134.42 R_G_CD.2
N$17
  Top 0.254: R7.2 160.12,102.87 155.09,97.84 153.72,97.84 OK4.1
N$18
  Top 0.254: R_F_AB.1 92.69,141.05 92.69,145.85 R_G_AB.2
  Bottom 0.254: IC7.2 139.55,123.22 138.63,123.22 128.35,133.5 106.17,133.5 98.86,140.82 92.91,140.82 R_F_AB.1
N$19
  Top 0.254: 152.58,74.98 152.58,80.01 | 152.58,80.01 155.09,82.53 157.38,82.53 CAP_CL.2 | 152.58,80.01 RES_BASE_CL.2 | 152.58,74.98 158.75,74.98 DB_CL.A 158.75,74.75 164.92,68.58 164.92,59.89 DR_CL.C | 152.58,74.98 DF_CL.A
N$20
  Top 0.254: 16.56,74.98 16.56,80.01 | 16.56,80.01 19.07,82.53 21.59,82.53 CAP_AH.2 | 16.56,80.01 RES_BASE_AH.2 | 16.56,74.98 22.73,74.98 DB_AH.A 22.96,74.75 29.13,68.58 29.13,59.89 DR_AH.C | 16.56,74.98 DF_AH.A
N$21
  Top 0.254: 38.28,74.98 38.28,80.01 | 38.28,80.01 40.79,82.53 43.08,82.53 CAP_BH.1 | 38.28,80.01 RES_BASE_BH.1 | 38.28,74.98 44.45,74.98 DB_BH.A 44.45,74.75 50.62,68.58 50.62,59.89 DR_BH.C | 38.28,74.98 DF_BH.A
N$25
  Bottom 0.254: IC1.4 110.29,119.56 75.77,119.56 71.88,123.44 64.57,123.44 63.65,124.36 IC4.2
N$27
  Top 0.254: OK8.1 174.07,98.98 174.07,102.87 R11.1
N$29
  Top 0.254: 174.07,74.98 174.07,80.01 | 174.07,80.01 176.58,82.53 178.87,82.53 CAP_DL.1 | 174.07,80.01 RES_BASE_DL.1 | 174.07,74.98 180.24,74.98 DB_DL.A 180.47,74.75 186.64,68.58 186.64,59.89 DR_DL.C | 174.07,74.98 DF_DL.A
N$30
  Top 0.254: R10.1 129.72,102.87 129.72,98.75 130.63,97.84 OK7.1
N$32
  Top 0.254: R9.1 81.48,102.87 81.48,98.75 82.4,97.84 OK6.1
N$33
  Top 0.254: R8.1 38.28,102.87 38.28,98.75 39.19,97.84 OK5.1
N$34
  Top 0.254: 177.04,89.61 178.87,87.78 CAP_DL.2 | 177.04,89.61 176.58,90.07 174.07,90.07 RES_BASE_DL.2 | 177.04,89.61 177.27,89.61 182.75,95.1 OK8.3
N$35
  Top 0.254: RES_BASE_BH.2 38.28,90.07 40.56,87.78 43.08,87.78 CAP_BH.2 43.31,87.78 46.97,91.44 46.97,95.1 OK5.3
N$36
  Top 0.254: RES_BASE_BL.2 83.77,86.41 86.28,86.41 CAP_BL.2 86.51,86.41 90.17,90.07 OK6.3
N$37
  Top 0.254: 135.89,87.78 133.15,87.78 130.86,90.07 RES_BASE_DH.2 | 135.89,87.78 138.41,90.3 138.41,95.1 OK7.3 | 135.89,87.78 CAP_DH.2
N$38
  Top 0.254: RES_BASE_CL.1 152.58,90.07 154.86,87.78 157.38,87.78 CAP_CL.1 157.61,87.78 161.26,91.44 161.26,95.1 OK4.3
N$39
  Top 0.254: RES_BASE_CH.2 109.37,90.07 111.66,87.78 114.17,87.78 CAP_CH.1 114.4,87.78 118.06,91.44 118.06,95.1 OK3.3
N$42
  Top 0.254: RES_BASE_AL.1 59.77,90.07 62.05,87.78 64.57,87.78 CAP_AL.1 64.8,87.78 68.45,91.44 68.45,95.1 OK2.3
N$43
  Top 0.254: 21.59,87.78 18.85,87.78 16.56,90.07 RES_BASE_AH.1 | 21.59,87.78 25.25,91.44 25.25,95.1 OK1.3 | 21.59,87.78 CAP_AH.1
N$46
  Top 0.254: C3.1 78.74,128.25 82.4,128.25 84.91,125.73 R1.1 85.14,125.73 85.14,124.13 87.43,121.84 87.43,115.67 IC8.5
N$47
  Top 0.254: IC8.3 R12.1 92.69,128.25 96.34,128.25 C4.1
OUT_A
  Top 0.254: D3.C D1.A
  Bottom 0.254: 46.74,48.69 55.88,39.55 D1.A | 46.74,48.69 45.36,50.06 45.36,51.21 AH.3 | 46.74,48.69 57.71,59.66 59.54,59.66 DF_AL.C | D3.C 55.88,24 64.11,24 82.85,5.26 87.66,5.26 OUT_A_B.1 87.88,5.26 94.74,12.12 94.74,13.95 93.83,14.86 93.6,14.86 89.94,18.52 89.94,42.06 92.23,44.35 92.23,46.86 AL.2
OUT_B
  Top 0.254: D4.C 99.08,28.12 99.08,37.95 D2.A 98.86,38.18 91.54,45.49 90.86,45.49 81.48,54.86 81.48,59.66 DF_BL.C | OUT_A_B.2 92.69,5.26 92.69,10.97 94.74,13.03 94.74,16.69 92.46,18.97 BL.2
  Bottom 0.254: D4.C 98.86,27.89 98.86,25.6 92.46,19.2 BL.2 | BH.3 45.36,23.32 81.25,59.21 81.25,59.66 DF_BL.C
OUT_C
  Top 0.254: D5.A 143.66,39.32 143.66,25.6 D7.C
  Bottom 0.254: 156.01,56.24 152.58,59.66 DF_CL.C | 156.01,56.24 163.78,48.46 179.78,48.46 CL.2 | 142.52,42.75 143.43,41.83 143.43,39.55 D5.A | 142.52,42.75 135.66,49.61 135.66,52.35 CH.3 | OUT_C_D.1 99.31,5.26 101.6,5.26 115.32,18.97 137.03,18.97 143.43,25.38 D7.C | 142.52,42.75 156.01,56.24
OUT_D
  Top 0.254: 128.58,18.75 135.43,25.6 DH.3 | 128.58,18.75 115.09,5.26 104.11,5.26 OUT_C_D.2 | DF_DL.C 174.07,59.66 177.04,59.66 187.78,48.92 187.78,39.55 D6.A 188.01,39.32 188.01,25.6 D8.C 187.78,25.6 180.01,17.83 DL.2 179.78,17.6 175.67,13.49 133.83,13.49 128.58,18.75
R_SENSE_A_B
  Top 0.254: 92.46,22.17 92.46,21.72 98.86,15.32 98.86,12.8 D4.A | 92.46,22.17 92.46,24.46 BL.3 | 92.46,22.17 79.2,8.91 55.88,8.91 D3.A | J28.1 183.9,178.76 183.9,169.39 J27.2 183.9,169.16 183.9,158.65 J2.1 183.9,158.42 183.9,147.68 J1.2 183.67,147.45 162.18,125.96 157.61,125.96 147.78,135.79 136.8,135.79 136.12,135.1 136.12,130.3 137.03,129.39 137.03,123.22 IC7.3
  Bottom 0.254: BL.3 92.46,24.69 94.74,26.98 94.74,47.55 92.46,49.84 92.46,52.35 AL.3 92.46,52.58 94.97,52.58 114.63,72.24 116.23,72.24 120.34,76.35 120.34,76.58 137.95,94.18 175.67,94.18 182.98,101.5 182.98,146.76 183.67,147.45 J1.2
R_SENSE_C_D  (via drill 0.61)
  Top 0.254: DL.3 180.01,23.32 182.3,25.6 182.3,48.69 180.01,50.98 180.01,53.72 CL.3 179.78,53.95 176.35,53.95 166.75,63.55 166.75,92.58 162.64,96.7 159.44,96.7 v157.38,98.75 | J4.1 55.42,144.47 55.42,134.42 J26.1 55.42,134.19 55.42,123.67 J25.2 55.42,123.44 55.42,113.39 J3.2
  Bottom 0.254: 180.01,20.8 180.01,20.57 187.78,12.8 187.78,10.29 D8.A | 180.01,20.8 180.01,23.09 DL.3 | 180.01,20.8 169.49,10.29 143.66,10.29 D7.A | 129.49,111.33 119.43,101.27 48.34,101.27 47.19,102.41 47.19,104.93 55.42,113.16 J3.2 | 129.49,111.33 133.6,115.44 134.52,115.44 IC7.5 | v157.38,98.75 154.86,98.75 151.89,101.73 139.09,101.73 129.49,111.33
SENSE01
  Bottom 0.254: 122.4,141.96 141.15,123.22 142.06,123.22 IC7.1 | 85.14,141.96 83.54,141.96 R_F_AB.2 | 85.14,141.96 122.4,141.96 | 85.14,141.96 85.14,136.02 R1.2 | 122.4,141.96 126.97,146.53 126.97,187.22 SENSE.1
SENSE01_FILTER
  Top 0.254: IC8.6 90.17,115.67 92.69,115.67 IC8.7 92.91,115.67 92.91,119.33 131.32,157.73 131.32,181.51 137.03,187.22 SENSE.3
SENSE02
  Top 0.254: IC7.7 139.55,115.44 138.63,115.44 137.72,114.53 136.58,114.53 135.66,115.44 135.66,120.7 127.2,129.16 127.2,130.76 R_F_CD.2 | R12.2 90.17,144.93 132,186.77 132,187.22 SENSE.2
  Bottom 0.254: R12.2 90.17,135.79 103.2,135.79 108,130.99 126.97,130.99 R_F_CD.2
SENSE02_FILTER
  Top 0.254: IC8.2 92.91,123.22 95.2,123.22 IC8.1 95.43,123.22 95.43,125.73 130.86,161.16 130.86,183.34 135.89,188.37 135.89,188.82 136.58,189.51 140,189.51 142.06,187.45 SENSE.4
VCC
  Top 0.254: DF_CH.C 109.14,59.66 102.97,53.49 99.08,53.49 D2.C 98.86,53.49 96.8,53.49 89.26,61.04 89.26,61.27 88.11,62.41 65.48,62.41 61.37,58.29 61.37,58.06 57.94,54.63 55.88,54.63 | DF_DH.C 130.86,59.66 130.86,51.66 135.43,47.09 CH.2 | 55.88,54.63 52.45,54.63 46.05,61.04 46.05,61.49 45.14,62.41 40.79,62.41 38.28,59.89 DF_BH.C | C1.+ 38.05,163.68 38.05,162.08 18.85,142.88 18.85,93.95 14.96,90.07 14.96,61.27 16.33,59.89 DF_AH.C | 55.88,54.63 D1.C
  Bottom 0.254: DH.2 135.66,20.34 135.66,23.09 137.95,25.38 137.95,44.58 135.66,46.86 CH.2 | D6.C 187.78,54.63 182.07,54.63 179.78,56.92 158.29,56.92 153.95,61.27 153.95,61.49 153.03,62.41 151.44,62.41 143.66,54.63 D5.C 143.43,54.63 135.89,54.63 130.86,59.66 DF_DH.C 130.63,59.66 127.89,56.92 115.09,56.92 112.34,59.66 109.37,59.66 DF_CH.C | POWER.1 16.56,185.85 23.19,179.22 30.28,179.22 D9.A 30.5,178.99 38.05,171.45 38.05,163.91 C1.+ | 45.14,45.72 42.85,43.43 42.85,22.86 45.14,20.57 45.14,17.83 BH.2 | 35.31,56.92 22.28,56.92 19.53,59.66 16.56,59.66 DF_AH.C | 35.31,56.92 38.05,59.66 DF_BH.C | 45.14,45.72 45.14,47.09 35.31,56.92 | 45.14,45.72 AH.2
VREF
  Top 0.254: VREF.S 18.85,161.85 18.85,170.99 16.56,173.28 1.1V_REF.1